# EAGLE design untitled (EAGLE 5.11)
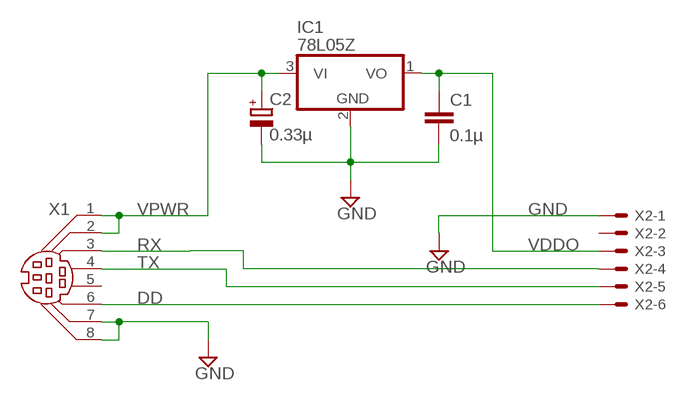
[diagram p0: schematic, sheet 1]

## Parts
C1  0.1µ  C2.5/2  [C2.5-2]
C2  0.33µ  CPOL-EUE2.5-6  [E2,5-6]
IC1  78L05Z  [TO92]
X1  MDIN08K  [MDIN08K]
X2  KK-156-6  [KK-156-6]

## Nets
DD: X1.6 X2.6
GND: C1.2 C2.- IC1.2(GND) X1.7 X1.8 X2.1
RX: X1.3 X2.4
TX: X1.4 X2.5
VDDO: C1.1 IC1.1(VO) X2.3
VPWR: C2.+ IC1.3(VI) X1.1 X1.2
Unconnected: X1.5 X2.2

## Library data of the parts
C1 = capacitor-wima:C: CAPACITOR naming: grid - package width
C2 = rcl:CPOL-EU: POLARIZED CAPACITOR, European symbol
IC1 = linear:78*: Positive VOLTAGE REGULATOR Source: http://cache.national.com/ds/LM/LM78L05.pdf http://www.fairchildsemi.com/ds/LM/LM7805.pdf
X1 = con-yamaichi:MDIN08K: YAMAICHI CONNECTOR; OC_FARNELL: unknown; OC_NEWARK: unknown
X2 = con-molex:KK-156-6: KK 156 HEADER Source: http://www.molex.com/pdm_docs/sd/026604100_sd.pdf; OC_FARNELL: unknown; OC_NEWARK: unknown

## Board
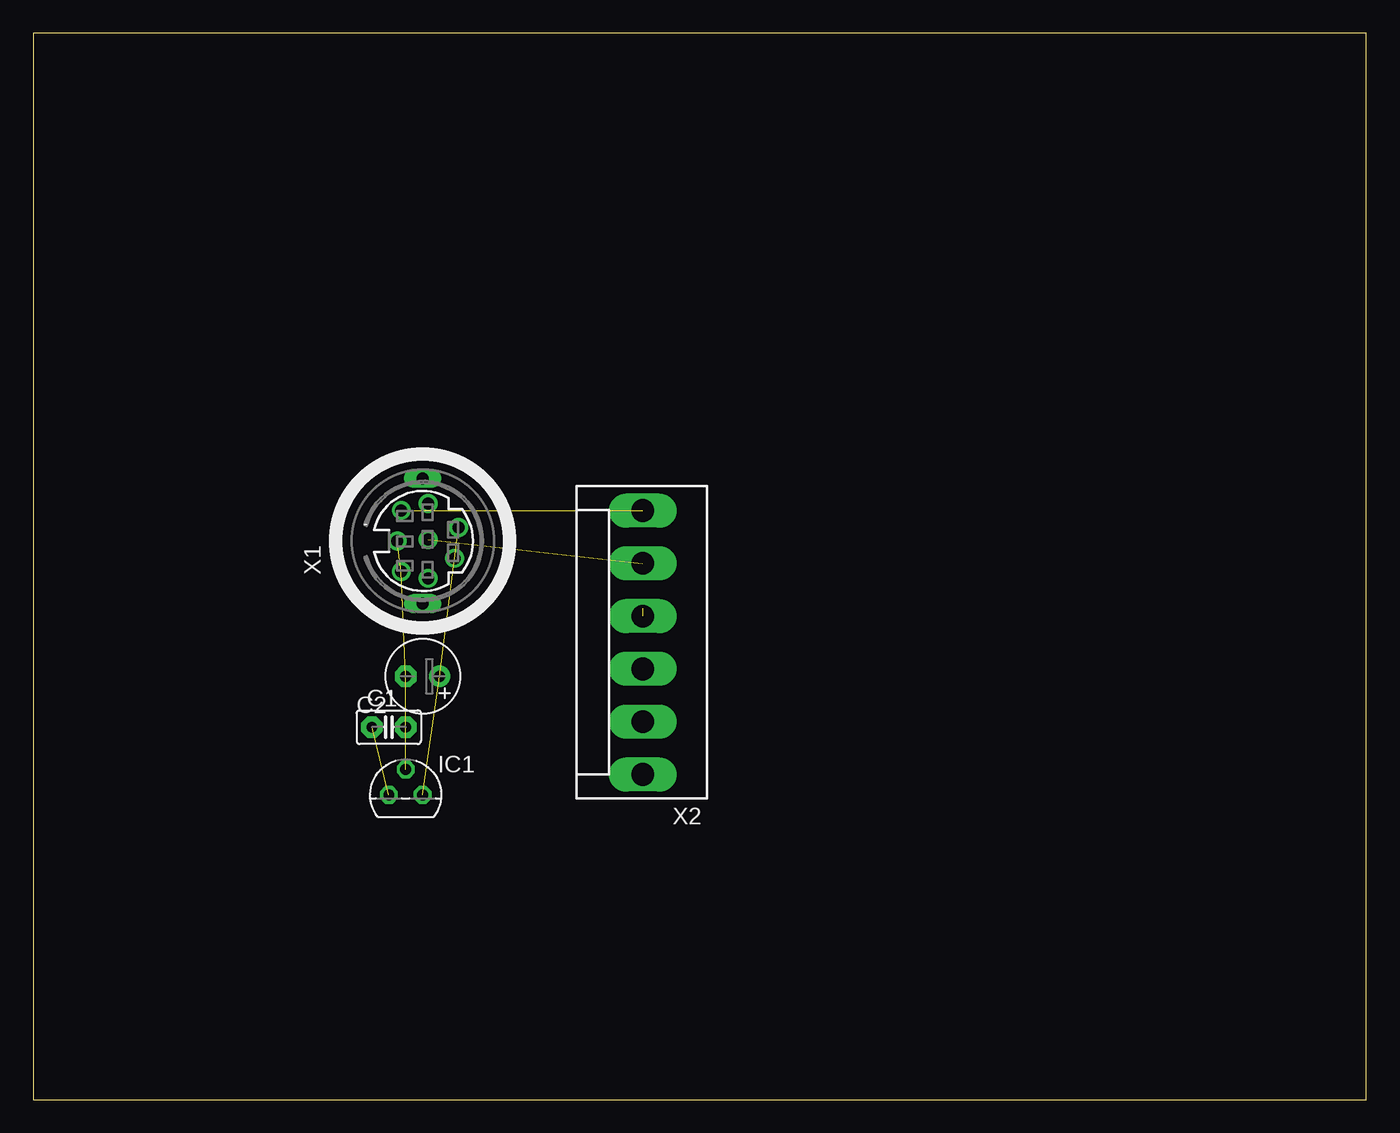
[diagram p1: board, top side]
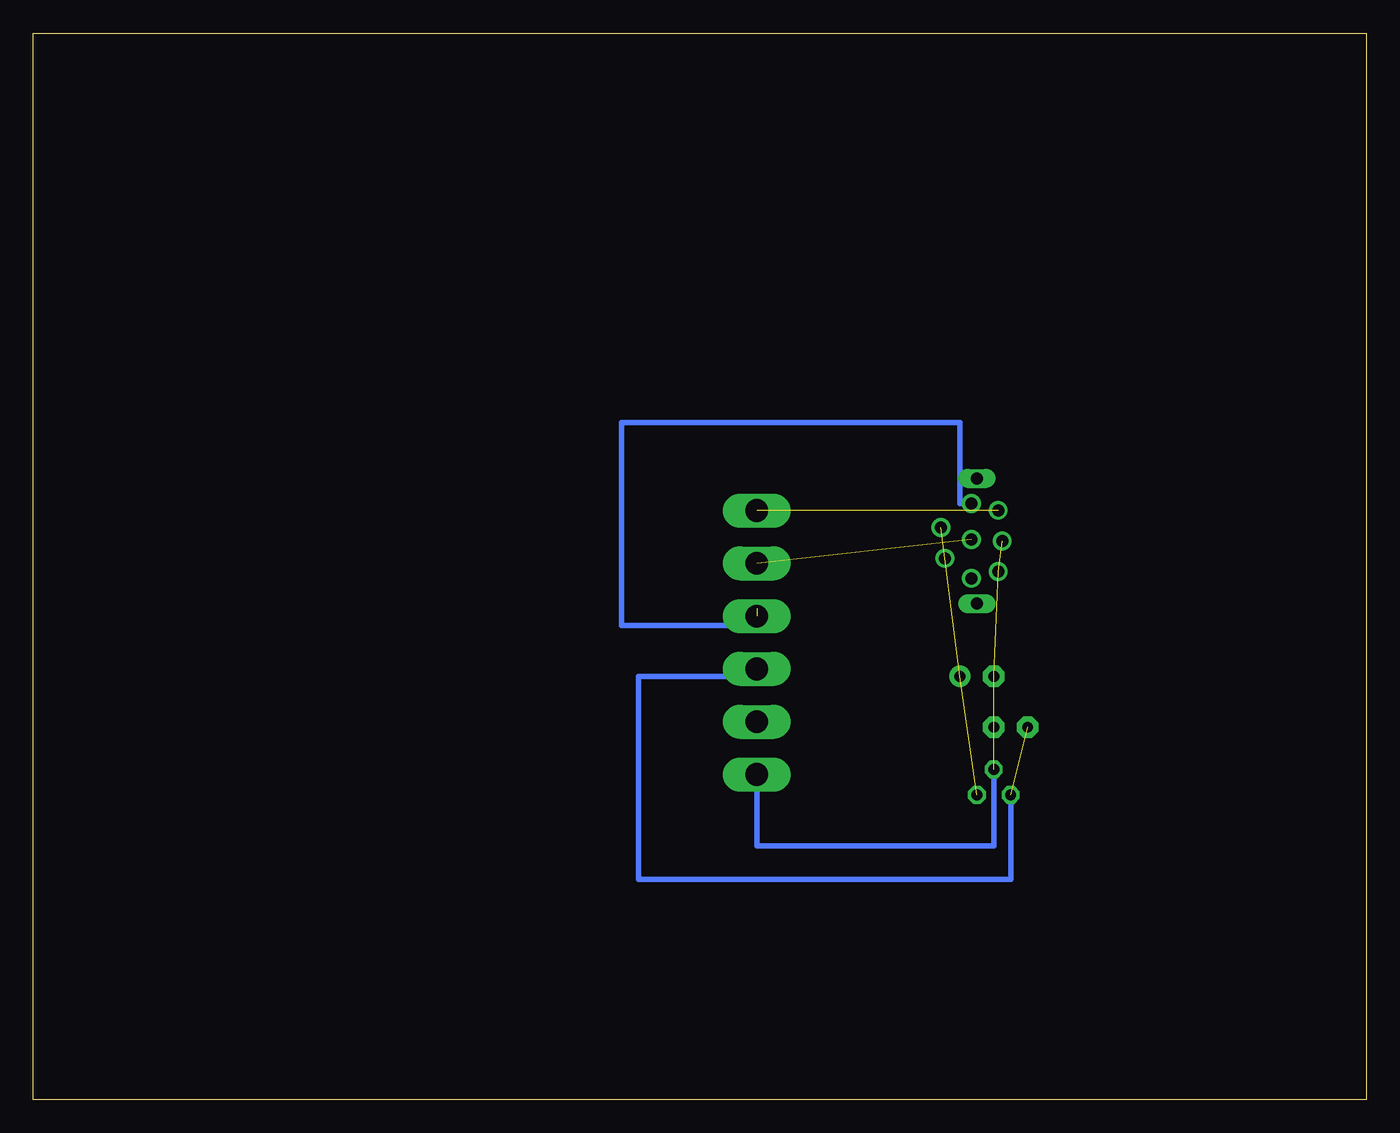
[diagram p2: board, bottom side, seen from below]

Size 100 x 80 mm. Coordinates in mm from the lower left corner, seen from the top.
Outline: 0,0 100,0 100,80 0,80 0,0
Copper layers (1*16): Top 0.035mm / dielectric 1.5mm / Bottom 0.035mm
Design rules "default": minimum track width 10mil, minimum drill 24mil, track to track 8mil, track to pad 8mil, pad to pad 8mil, via to via 8mil, smd to smd 8mil, copper to edge 40mil, drill to drill 8mil, minimum pad ring 10mil, minimum via ring 8mil, stop-mask expansion 4mil, vias tented up to drill 0mil, thermal gap 10mil

### Footprints (pad centres in the part's own frame; a part is rotated, then mirrored left to right if it is on the bottom)
C2.5-2 = drill 0.813 pad 1.6 octagon: 1 -1.27,0; 2 1.27,0
E2,5-6 = drill 0.813 pad 1.6 round: + -1.27,0 | drill 0.813 pad 1.6 octagon: - 1.27,0
TO92 = drill 0.813 octagon: 1 -1.27,0; 2 0,1.905; 3 1.27,0
MDIN08K = drill 0.9 round: 1 1,-2.7; 2 -1.3,-2.4; 3 2.8,-0.4; 4 0.1,-0.4; 5 -2.8,-0.4; 6 2.3,1.6; 7 0,1.9; 8 -2.3,1.6 | drill 0.9 long: M1 -4.7,0; M2 4.7,0
KK-156-6 = drill 1.7 pad 2.184 long: 1 -9.9,0; 2 -5.94,0; 3 -1.98,0; 4 1.98,0; 5 5.94,0; 6 9.9,0

### Placement (x,y rotation side)
C1  26.67,27.94 0 top
C2  29.21,31.75 180 top
IC1  27.94,22.86 0 top
X1  29.21,41.91 90 top
X2  45.72,34.29 90 top

### Tracks (layer width: path | path; a pad name or v marks a point on that pad's centre or on a via)
DD  (1 unrouted)
GND  (4 unrouted)
  Bottom 0.406: IC1.2 27.94,19.05 45.72,19.05 X2.1
RX  (1 unrouted)
  Bottom 0.406: X1.3 30.48,44.71 30.48,50.8 55.88,50.8 55.88,49.53 55.88,35.56 45.72,35.56 45.72,36.83
TX  (1 unrouted)
VDDO  (1 unrouted)
  Bottom 0.406: IC1.1 26.67,16.51 54.61,16.51 54.61,31.75 45.72,31.75 X2.3
VPWR  (3 unrouted)